# EAGLE board pc_badge_hrv_v1.1 (EAGLE 6.6.0), part 1 of 2
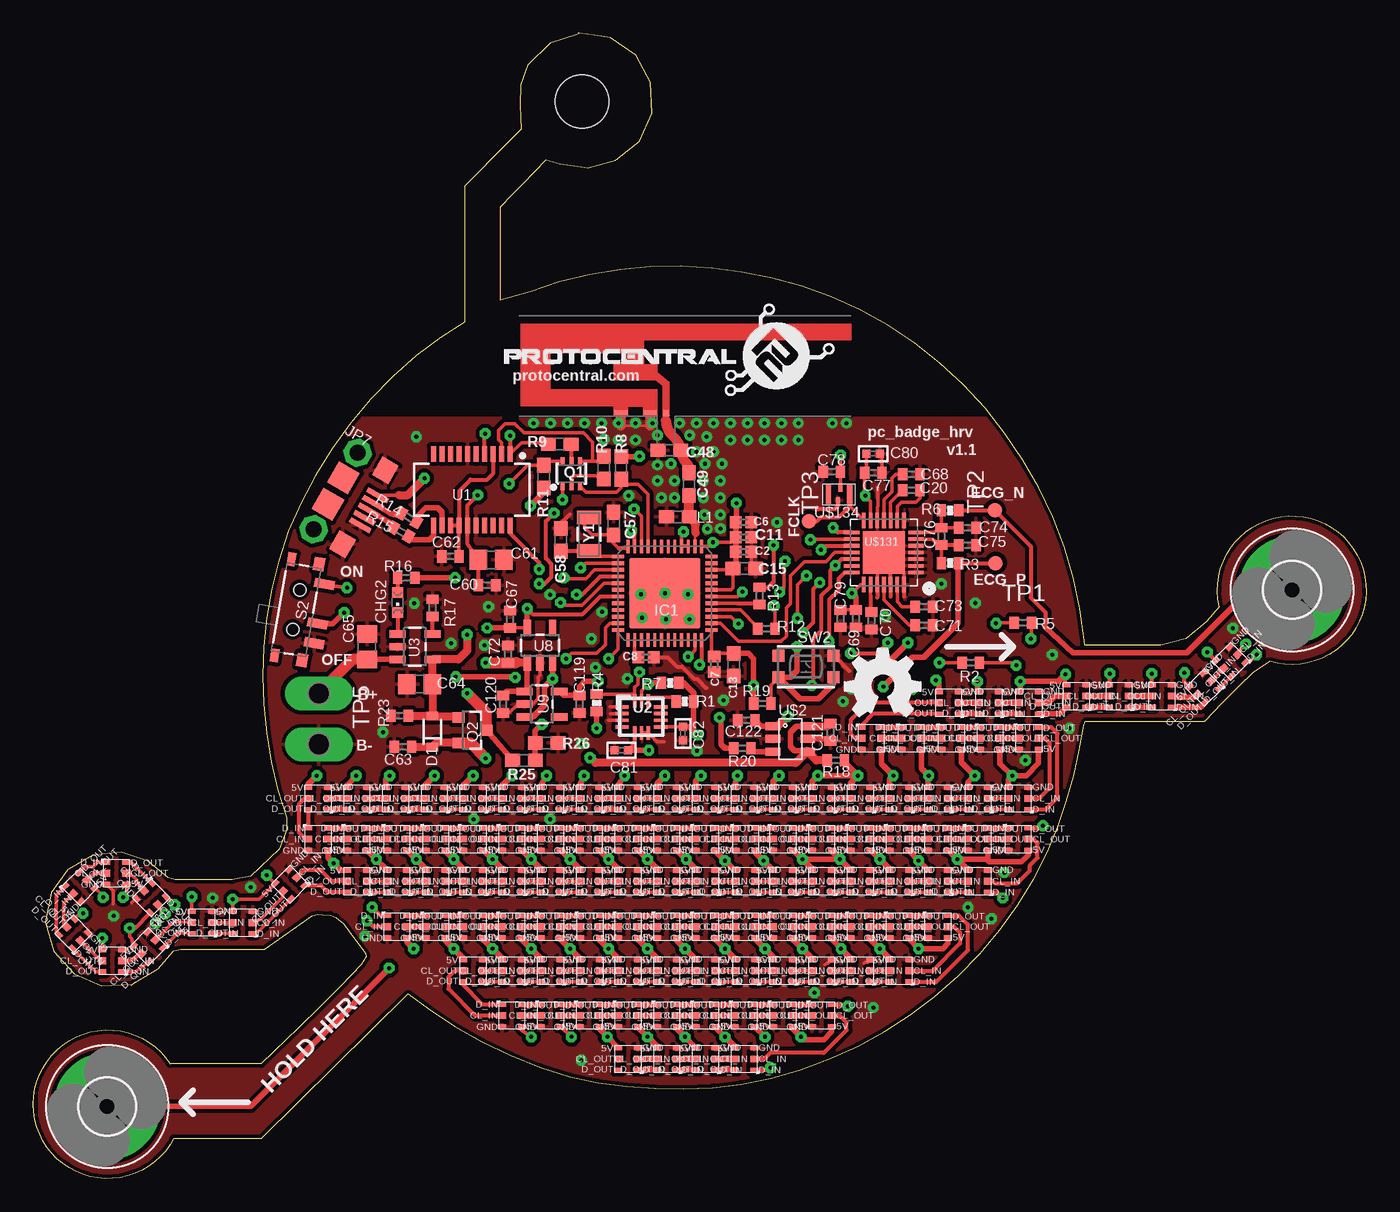
[diagram p3: board, top side]
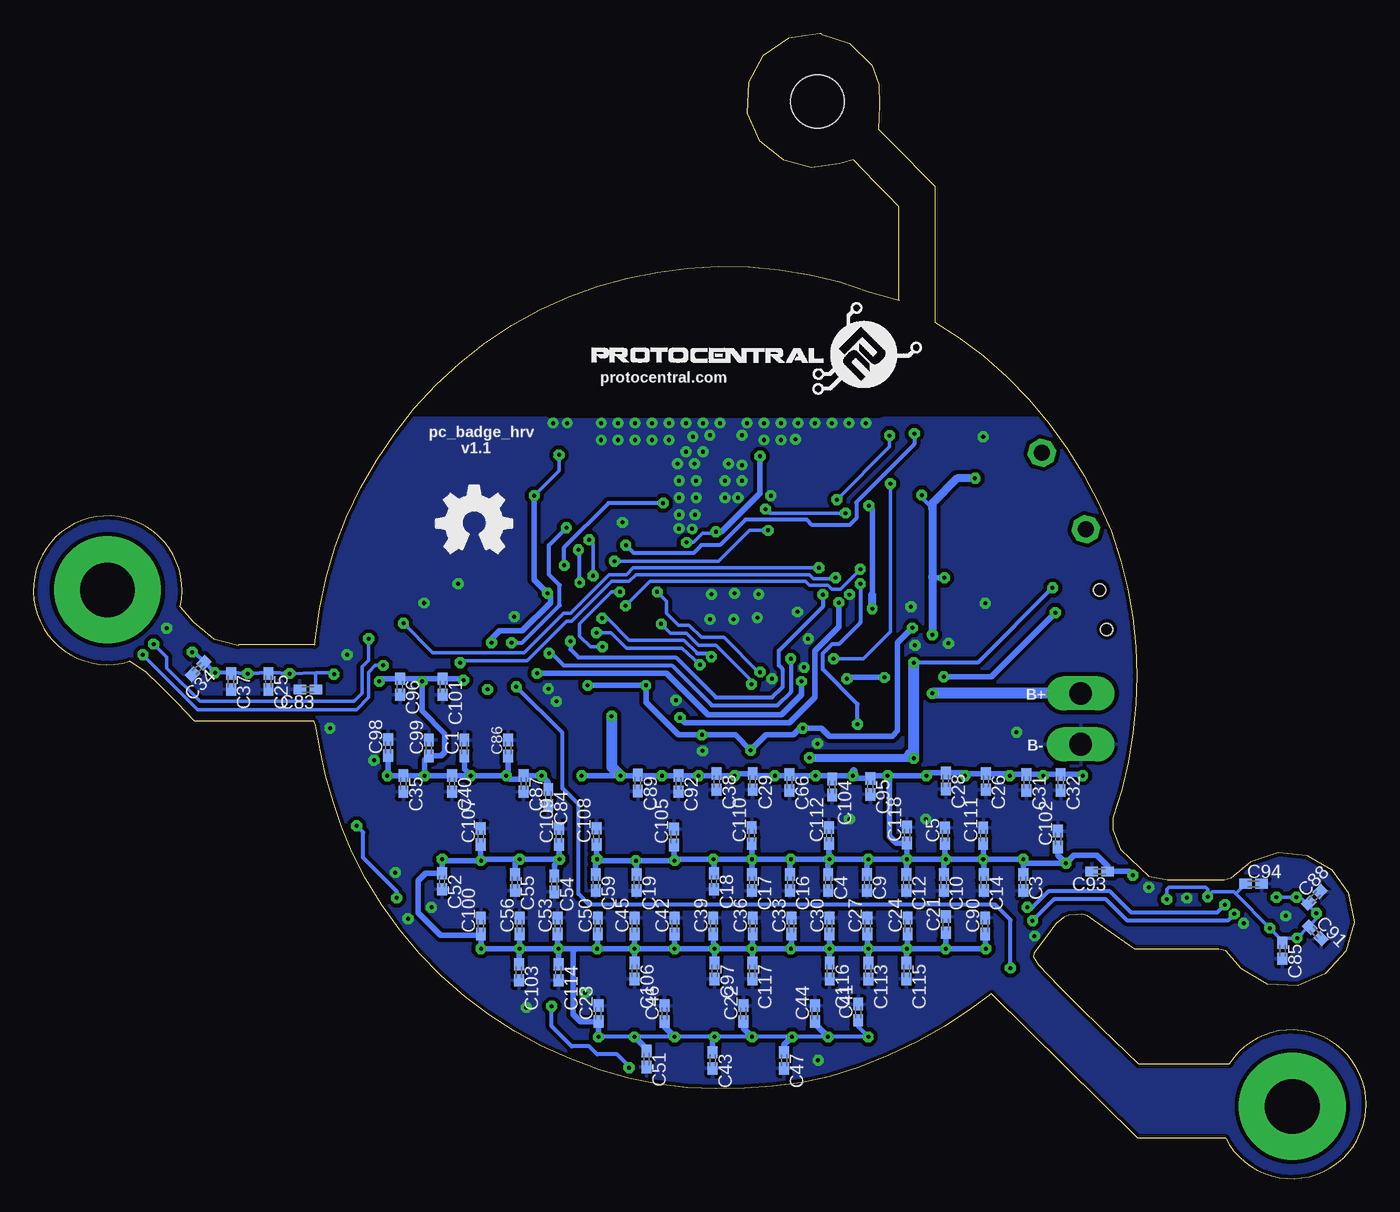
[diagram p4: board, bottom side, seen from below]

Size 99.76 x 85.69 mm. Coordinates in mm from the lower left corner, seen from the top.
Outline: 40.77,85.64 38.66,84.96 37.01,83.3 36.47,81.85 36.43,80.3 36.5,78.51 35.46,77.46 34.43,76.42 33.35,75.33 32.28,74.25 32.28,64.09 30.53,62.95 28.64,61.57 26.88,60.01 25.26,58.32 23.76,56.52 22.38,54.62 21.13,52.64 20.03,50.57 19.09,48.42 18.34,46.2 17.84,44.09 17.47,41.96 17.25,39.81 17.18,37.64 17.24,35.48 17.45,33.32 17.8,31.19 18.29,29.08 18.94,27.02 18.94,26.68 18.94,26.1 18.39,24.64 16.25,22.63 14.84,22.35
Outline: 14.88,22.36 10.62,22.38 10.1,22.51 8.59,23.76 6.56,24.41 4.44,24.18 2.58,23.13 1.32,21.4 0.88,19.18 1.52,17 3.04,15.32 5.12,14.42 7.38,14.54 9.32,15.69 10.52,17.06 11.03,17.15 17.3,17.15 19.43,18.66 20.88,19.68 21.26,19.78 21.64,19.74 22.23,19.71 22.63,19.57 23.22,19.07 24.04,17.96 24.86,16.85 24.9,16.59 24.51,15.98 23.01,14.39 21.45,12.86 19.84,11.29 17.06,8.59
Outline: 17.06,8.6 10.25,8.6
Outline: 10.5,3.01 17.1,3.01 28.04,13.82
Outline: 28.04,13.82 29.59,12.7 31.54,11.38 33.6,10.24 35.73,9.22 37.91,8.34 40.16,7.62 42.26,7.18 44.39,6.9 46.53,6.75 48.68,6.72 50.83,6.81 52.96,7.06 55.22,7.52 57.44,8.15 59.6,8.95 61.7,9.9 63.73,11.01 65.66,12.27 67.43,13.59 69.23,15.19 70.84,16.84 72.33,18.6 73.68,20.48 74.88,22.44 75.93,24.5 76.68,26.34 77.33,28.23 77.88,30.14 78.3,32.08 78.63,33.92 78.76,34.21 87.7,34.21 89,35.62 90.24,36.86 91.35,37.91 92.57,38.69
Outline: 88.77,42.8 87.8,41.65 86.28,40.41 84.38,39.93
Outline: 78.71,39.91 78.66,40.25 78.35,42.63 77.84,44.97 77.16,47.27 76.3,49.51 75.27,51.68 74.08,53.76 72.74,55.75 71.25,57.63 69.62,59.39 67.86,61.02 65.97,62.51 63.98,63.84 61.88,65 59.69,65.99 57.53,66.76 55.31,67.38 53.06,67.84 50.78,68.13 48.49,68.26 46.19,68.23 43.9,68.02 41.63,67.65 39.4,67.1 37.22,66.37 34.95,65.73
Outline: 34.98,65.73 34.98,72.72 35.83,73.61 36.69,74.49 37.54,75.36 38.39,76.24 39.41,75.93 41.53,75.63 43.59,76.19 45.37,77.64 46.29,79.73 46.19,82.02 45.12,84.05 43.21,85.38 41.99,85.54 40.87,85.69 40.77,85.69
Outline: 78.67,39.95 84.39,39.94
Outline: 88.77,42.8 arc-300 92.57,38.7
Outline: 10.51,3.01 arc-300 10.24,8.59
Copper layers (1*2*15*16): Top 0.035mm / dielectric 1.5mm / Route2 0.035mm / dielectric 0.15mm / Route15 0.035mm / dielectric 0.2mm / Bottom 0.035mm
Design rules "Circuitects-Rules": minimum track width 6mil, minimum drill 0.3mm, track to track 6mil, track to pad 6mil, pad to pad 6mil, via to via 6mil, smd to smd 6mil, copper to edge 10mil, drill to drill 8mil, minimum pad ring 12mil, minimum via ring 10mil, stop-mask expansion 4mil, vias tented up to drill 25mil, thermal gap 10mil
Net classes: 2 gnd: width 0.102 mm, drill 0.1 mm; 4 USBpair: width 0.102 mm, drill 0.1 mm, clearance 0.15 mm to class 3
Holes 4 mm at 41.07,80.6

## Footprints (pad centres in the part's own frame; a part is rotated, then mirrored left to right if it is on the bottom)
C0402K = smd 0.925 x 0.74: 1 -0.6,0; 2 0.6,0
0402 = smd 0.85 x 0.9: 1 -0.58,0; 2 0.58,0
0603 = smd 1.1 x 1: 1 -0.85,0; 2 0.85,0
C0402 = smd 0.7 x 0.9: 1 -0.65,0; 2 0.65,0
C0805 = smd 1.3 x 1.5: 1 -0.95,0; 2 0.95,0
_0402 = smd 0.6 x 0.6: 1 -0.508,0; 2 0.508,0
CHIPLED_0603 = smd 0.8 x 0.8: A 0,-0.75; C 0,0.75
SOD-323 = smd 0.63 x 0.83: A 1.15,0; C -1.15,0
TRACE_ANTENNA_2.4GHZ_25.7MM_TUNED = smd 0.46 x 0.46: ANT 0,0.23 | smd 1 x 0.46: GND -1.18,0.23; GND2 -3.38,0.23
4,1-PAD = drill 4.1 pad 8: B4,1 0,0
QFN48 = smd 1 x 0.3: 1 -3.5,2.75; 2 -3.5,2.25; 3 -3.5,1.75; 4 -3.5,1.25; 5 -3.5,0.75; 6 -3.5,0.25; 7 -3.5,-0.25; 8 -3.5,-0.75; 9 -3.5,-1.25; 10 -3.5,-1.75; 11 -3.5,-2.25; 12 -3.5,-2.75; 25 3.5,-2.75; 26 3.5,-2.25; 27 3.5,-1.75; 28 3.5,-1.25; 29 3.5,-0.75; 30 3.5,-0.25; 31 3.5,0.25; 32 3.5,0.75; 33 3.5,1.25; 34 3.5,1.75; 35 3.5,2.25; 36 3.5,2.75 | smd 0.3 x 1: 13 -2.75,-3.5; 14 -2.25,-3.5; 15 -1.75,-3.5; 16 -1.25,-3.5; 17 -0.75,-3.5; 18 -0.25,-3.5; 19 0.25,-3.5; 20 0.75,-3.5; 21 1.25,-3.5; 22 1.75,-3.5; 23 2.25,-3.5; 24 2.75,-3.5; 37 2.75,3.5; 38 2.25,3.5; 39 1.75,3.5; 40 1.25,3.5; 41 0.75,3.5; 42 0.25,3.5; 43 -0.25,3.5; 44 -0.75,3.5; 45 -1.25,3.5; 46 -1.75,3.5; 47 -2.25,3.5; 48 -2.75,3.5 | smd 5.309 x 5.309: EXP 0,0
MICRO-B = smd 0.4 x 1.75: 1 -1.25,2.975; 2 -0.6,2.975; 3 0.05,2.975; 4 0.7,2.975; 5 1.35,2.975 | smd 1.8 x 1.8: P$1 -1.1,0.1; P$2 1.2,0.1 | drill 1.2 pad 2 octagon: P$3 -3.25,0.1; P$4 3.35,0.1 | smd 1.6 x 1.4: P$5 -3.15,2.55; P$6 3.25,2.55
SC70-6 = smd 0.3 x 0.66: 1 -0.65,-0.92; 2 0,-0.92; 3 0.65,-0.92; 4 0.65,0.92; 5 0,0.92; 6 -0.65,0.92
SOT23-3 = smd 0.8 x 0.9: 1 -0.95,-1; 2 0.95,-1; 3 0,1.1
0402-RES = smd 0.7 x 0.9: 1 -0.65,0; 2 0.65,0
R0402 = smd 0.7 x 0.9: 1 -0.65,0; 2 0.65,0
SWITCH-SPST-SMD-A = smd 0.7 x 1.5: 1 -2.25,-1.75; 2 -0.75,-1.75; 3 2.25,-1.75 | smd 1 x 0.6: GND1 -3.65,1; GND3 3.65,1 | smd 1 x 0.8: GND2 -3.65,-1.1; GND4 3.65,-1.1 | hole 0.9: -1.5,0; 1.5,0
BTN_KMR2_4.6X2.8 = smd 0.9 x 0.9: A 2.05,0.8; A' -2.05,0.8; B 2.05,-0.8; B' -2.05,-0.8
TP11R = smd 1.1 x 1.1: TP 0,0
P2-38-17 = drill 1.702 pad 2.121 long: TP-1 -1.905,0; TP-2 1.905,0
SSOP20_L = smd 0.381 x 1.143: 1 -2.857,-2.68; 2 -2.223,-2.68; 3 -1.587,-2.68; 4 -0.953,-2.68; 5 -0.318,-2.68; 6 0.318,-2.68; 7 0.953,-2.68; 8 1.587,-2.68; 9 2.223,-2.68; 10 2.857,-2.68; 11 2.857,2.68; 12 2.223,2.68; 13 1.587,2.68; 14 0.953,2.68; 15 0.318,2.68; 16 -0.318,2.68; 17 -0.953,2.68; 18 -1.587,2.68; 19 -2.223,2.68; 20 -2.857,2.68
LGA14L = smd 1 x 0.25: 1 -1.45,0.75; 2 -1.45,0.25; 3 -1.45,-0.25; 4 -1.45,-0.75; 8 1.45,-0.75; 9 1.45,-0.25; 10 1.45,0.25; 11 1.45,0.75 | smd 0.25 x 1: 5 -0.5,-1.2; 6 0,-1.2; 7 0.5,-1.2; 12 0.5,1.2; 13 0,1.2; 14 -0.5,1.2
SOT23-5 = smd 0.55 x 1.2: 1 -0.95,-1.3; 2 0,-1.3; 3 0.95,-1.3; 4 0.95,1.3; 5 -0.95,1.3
SOT26 = smd 0.6 x 1.1: 1 -0.95,-1.3; 2 0,-1.3; 3 0.95,-1.3; 4 0.95,1.3; 5 0,1.3; 6 -0.95,1.3
APA102_2020 = smd 0.6 x 0.5: C_IN 0.25,1; CL_OUT 1.75,1 | smd 0.6 x 0.35: D_IN 0.25,1.825; D_OUT 1.75,1.825; GND 0.25,0.175; V_CC 1.75,0.175
QFN-28 = smd 1.15 x 0.27: 1 -2.4,1.5; 2 -2.4,1; 3 -2.4,0.5; 4 -2.4,0; 5 -2.4,-0.5; 6 -2.4,-1; 7 -2.4,-1.5; 15 2.4,-1.5; 16 2.4,-1; 17 2.4,-0.5; 18 2.4,0; 19 2.4,0.5; 20 2.4,1; 21 2.4,1.5 | smd 0.27 x 1.15: 8 -1.5,-2.4; 9 -1,-2.4; 10 -0.5,-2.4; 11 0,-2.4; 12 0.5,-2.4; 13 1,-2.4; 14 1.5,-2.4; 22 1.5,2.4; 23 1,2.4; 24 0.5,2.4; 25 0,2.4; 26 -0.5,2.4; 27 -1,2.4; 28 -1.5,2.4 | smd 3.15 x 3.15: THERMAL 0,0
SIT1533 = smd 0.4 x 1.4: 1 -0.8,0; 3 0.8,0 | smd 0.3 x 0.5: 2 -0.1,-0.45; 4 0.1,0.45
CRYSTAL-SMD-3.2X1.5MM = smd 1 x 1.8: P$1 -1.25,0; P$2 1.25,0

## Placement (x,y rotation side)
C1  [C0402K]  67.5,32.21 90 bottom
C2  0.1uF  [0402]  53.17,46.9 0 top
C3  [C0402K]  25.67,22.15 270 bottom
C4  [C0402K]  40.27,22.15 270 bottom
C5  [C0402K]  31.52,25.65 90 bottom
C6  0.1uF  [0402]  53.17,49.1 0 top
C7  0.1uF  [0402]  50.97,38.5 270 top
C8  0.1uF  [0402]  45.87,39 0 top
C9  [C0402K]  37.37,22.15 270 bottom
C10  [C0402K]  31.62,22.15 270 bottom
C11  0.1uF  [0402]  53.17,48 0 top
C12  [C0402K]  34.42,22.15 270 bottom
C13  10uF  [0603]  52.42,38.45 270 top
C14  [C0402K]  28.62,22.15 270 bottom
C15  10uF  [0603]  53.22,45.65 0 top
C16  [C0402K]  43.12,22.15 270 bottom
C17  [C0402K]  45.97,22.15 270 bottom
C18  [C0402K]  48.82,22.25 270 bottom
C19  [C0402K]  54.62,22.15 270 bottom
C20  1uF  [C0402]  65.72,51.5 180 top
C21  [C0402K]  31.47,19 90 bottom
C22  [C0402K]  46.62,12.35 90 bottom
C23  [C0402K]  57.47,12.35 90 bottom
C24  [C0402K]  34.32,18.9 90 bottom
C25  [C0402K]  82.17,37.19 270 bottom
C26  [C0402K]  28.47,29.7 270 bottom
C27  [C0402K]  37.32,18.9 90 bottom
C28  [C0402K]  31.47,29.75 270 bottom
C29  [C0402K]  45.92,29.7 270 bottom
C30  [C0402K]  40.17,18.9 90 bottom
C31  [C0402K]  25.42,29.65 270 bottom
C32  [C0402K]  22.87,29.65 270 bottom
C33  [C0402K]  43.02,18.9 90 bottom
C34  [C0402K]  87.42,38.17 225 bottom
C35  [C0402K]  72.07,29.55 270 bottom
C36  [C0402K]  45.92,18.9 90 bottom
C37  [C0402K]  84.97,37.2 270 bottom
C38  [C0402K]  48.62,29.7 270 bottom
C39  [C0402K]  48.87,18.9 90 bottom
C40  [C0402K]  68.42,29.55 270 bottom
C41  [C0402K]  38.02,12.45 90 bottom
C42  [C0402K]  51.77,18.9 90 bottom
C43  [C0402K]  48.92,8.85 270 bottom
C44  [C0402K]  41.27,12.35 90 bottom
C45  [C0402K]  54.77,18.9 90 bottom
C46  [C0402K]  52.52,12.35 90 bottom
C47  [C0402K]  43.57,8.85 270 bottom
C48  2.4pF  [0603]  47.61,54.51 180 top
C49  5.6pF  [0603]  49.08,51.97 90 top
C50  [C0402K]  57.52,18.9 90 bottom
C51  [C0402K]  53.87,8.95 270 bottom
C52  [C0402K]  69.17,22.25 270 bottom
C53  [C0402K]  60.52,18.9 90 bottom
C54  [C0402K]  60.77,22.05 270 bottom
C55  [C0402K]  63.72,22.15 270 bottom
C56  [C0402K]  63.37,18.9 90 bottom
C57  15pF  [0603]  43.42,49.01 270 top
C58  15pF  [0603]  39.49,47.8 270 top
C59  [C0402K]  57.67,22.15 270 bottom
C60  0.1uF  [C0402]  33.97,44.4 0 top
C61  10uF  [C0805]  34.27,46.3 0 top
C62  0.1uF  [C0402]  31.22,46.55 180 top
C63  1.0uF  [C0402]  27.67,32.3 180 top
C64  4.7u  [C0805]  28.92,37 180 top
C65  4.7u  [C0805]  24.97,39.8 90 top
C66  [C0402K]  43.17,29.65 270 bottom
C67  2.2uF  [C0402]  35.67,41.85 90 top
C68  1nF  [C0402]  65.72,52.7 0 top
C69  1uF  [C0402]  61.57,41.9 270 top
C70  10uF  [C0402]  62.72,41.75 270 top
C71  10uF  [C0402]  66.67,41.4 0 top
C72  1u  [C0402]  35.52,39.25 270 top
C73  1uF  [C0402]  66.67,42.8 0 top
C74  10pF  [C0402]  69.92,48.7 0 top
C75  10pF  [C0402]  69.92,47.4 0 top
C76  1000pF  [C0402]  67.97,48.05 90 top
C77  10uF  [C0402]  62.87,52.8 0 top
C78  1uF  [C0402]  59.77,52.9 180 top
C79  10uF  [C0402]  60.42,41.9 270 top
C80  1uF  [_0402]  62.87,54.25 0 top
C81  100nF  [_0402]  44.02,32.05 180 top
C82  100nF  [_0402]  48.62,33.3 270 top
C83  [C0402K]  79.22,36.6 180 bottom
C84  [C0402K]  61.22,28.51 270 bottom
C85  [C0402K]  6.27,17.05 270 bottom
C86  [C0402K]  64.22,32.21 90 bottom
C87  [C0402K]  63.07,29.55 270 bottom
C88  [C0402K]  3.87,21.05 45 bottom
C89  [C0402K]  54.52,29.6 270 bottom
C90  [C0402K]  28.52,18.9 90 bottom
C91  [C0402K]  3.79,18.39 315 bottom
C92  [C0402K]  51.47,29.55 270 bottom
C93  [C0402K]  19.94,22.98 180 bottom
C94  [C0402K]  8.42,22.05 0 bottom
C95  [C0402K]  37.12,29.35 270 bottom
C96  [C0402K]  72.32,36.8 270 bottom
C97  [C0402K]  48.77,15.54 270 bottom
C98  [C0402K]  73.21,32.26 90 bottom
C99  [C0402K]  70.16,32.23 90 bottom
C100  [C0402K]  66.27,18.9 90 bottom
C101  [C0402K]  69.12,36.8 270 bottom
C102  [C0402K]  23.07,25.4 90 bottom
C103  [C0402K]  63.42,15.44 270 bottom
C104  [C0402K]  39.97,29.3 270 bottom
C105  [C0402K]  51.82,25.55 90 bottom
C106  [C0402K]  54.77,15.54 270 bottom
C107  [C0402K]  66.28,25.6 90 bottom
C108  [C0402K]  57.62,25.61 90 bottom
C109  [C0402K]  60.43,25.59 90 bottom
C110  [C0402K]  45.99,25.66 90 bottom
C111  [C0402K]  28.67,25.65 90 bottom
C112  [C0402K]  40.21,25.67 90 bottom
C113  [C0402K]  37.27,15.54 270 bottom
C114  [C0402K]  60.46,15.44 270 bottom
C115  [C0402K]  34.4,15.54 270 bottom
C116  [C0402K]  40.16,15.54 270 bottom
C117  [C0402K]  45.95,15.54 270 bottom
C118  [C0402K]  34.37,25.7 90 bottom
C119  1u  [C0402]  40.87,35.5 90 top
C120  1u  [C0402]  35.17,35.5 90 top
C121  10uF  [C0402]  59.67,33.4 270 top
C122  10uF  [C0402]  53.37,34.3 180 top
CHG2  RED  [CHIPLED_0603]  27.27,43.1 180 top
D1  BAT20J  [SOD-323]  29.87,33.45 90 top
E1  ANTENNA  [TRACE_ANTENNA_2.4GHZ_25.7MM_TUNED]  47.35,57.05 0 top
H1  MOUNT-PAD-ROUND4.1  [4,1-PAD]  5.52,5.4 0 top
H2  MOUNT-PAD-ROUND4.1  [4,1-PAD]  94.22,44.05 0 top
IC1  CY8C29666_QFN48  [QFN48]  47.27,43.8 270 top
JP7  MICRO-B  [MICRO-B]  22.56,51.54 240 top
L1  2.7nH  [0603]  48.24,49.53 180 top
LOGO2  OSHW_LOGO_FILLX0200-NT  [OSHW_FILLX200_NOTEXT]  69.61,46.79 0 bottom
LOGO3  OSHW_LOGO_FILLX0200-NT  [OSHW_FILLX200_NOTEXT]  60.75,34.59 0 top
Q1  MBT3904DW1T1  [SC70-6]  40.27,52.74 0 top
Q2  2.5A/30V  [SOT23-3]  32.82,33.55 270 top
R1  10K  [0402-RES]  48.77,35.7 0 top
R2  330R  [R0402]  70.17,38.6 180 top
R3  49.9K  [0402-RES]  68.62,46.05 180 top
R4  10K  [0402-RES]  42.17,35.6 270 top
R5  330R  [R0402]  74.07,41.6 180 top
R6  49.9K  [0402-RES]  68.62,50 180 top
R7  10K  [0402-RES]  47.67,37.1 0 top
R8  10k  [0603]  44,53.18 90 top
R9  10k  [0603]  39.4,54.95 0 top
R10  10k  [0603]  42.7,53.2 270 top
R11  10k  [0603]  38.2,52.53 270 top
R12  1K  [R0402]  54.87,41.15 0 top
R13  1K  [R0402]  54.37,43.6 90 top
R14  27  [R0402]  28.11,49.46 330 top
R15  27  [R0402]  27.52,48.39 330 top
R16  330R  [R0402]  27.92,44.95 180 top
R17  1k  [R0402]  29.87,42.7 270 top
R18  DNP  [R0402]  60.07,31.3 0 top
R19  10K  [R0402]  54.57,35.55 180 top
R20  10k  [R0402]  53.07,32.2 180 top
R23  10K  [R0402]  27.42,34.65 0 top
R25  10k  [0603]  36.72,31.3 180 top
R26  10k  [0603]  38.42,32.6 180 top
S2  PCM12SMTR  [SWITCH-SPST-SMD-A]  19.68,42.57 80 top
SW2  KMR2  [BTN_KMR2_4.6X2.8]  57.84,38.31 0 top
TP1  TPSQTP11R  [TP11R]  72.02,46.05 90 top
TP2  TPSQTP11R  [TP11R]  71.97,50 90 top
TP3  TPSQTP11R  [TP11R]  58.07,49.2 0 top
TP5  PTR2  [P2-38-17]  21.37,34.4 270 top
U1  FTS31XS-U  [SSOP20_L]  32.82,51.55 180 top
U2  LSM6DS3  [LGA14L]  45.52,34.55 0 top
U3  MCP73831  [SOT23-5]  28.57,39.8 270 top
U8  AP2112K-3.3V  [SOT23-5]  37.92,39.9 0 top
U9  AP2112K-1.8V  [SOT23-5]  38.07,35.5 270 top
U$1  PROTY_LOGO_WITH_TEXT  [PROTY_WITH_TEXT@1]  57.96,59.03 0 bottom
U$2  AP2281  [SOT26]  56.67,32.9 270 top
U$9  APA1022020  [APA102_2020]  89.62,40.11 225 top
U$10  APA1022020  [APA102_2020]  87.65,38.15 225 top
U$11  APA1022020  [APA102_2020]  85.47,37.1 180 top
U$12  APA1022020  [APA102_2020]  82.27,37.1 180 top
U$13  APA1022020  [APA102_2020]  79.07,37.1 180 top
U$14  APA1022020  [APA102_2020]  75.52,36.6 180 top
U$15  APA1022020  [APA102_2020]  72.52,36.6 180 top
U$18  APA1022020  [APA102_2020]  69.52,36.6 180 top
U$19  APA1022020  [APA102_2020]  61.72,31.95 0 top
U$20  APA1022020  [APA102_2020]  64.72,31.95 0 top
U$21  APA1022020  [APA102_2020]  67.72,31.95 0 top
U$22  APA1022020  [APA102_2020]  70.62,31.95 0 top
U$24  APA1022020  [APA102_2020]  73.52,31.95 0 top
U$25  APA1022020  [APA102_2020]  74.72,29.45 180 top
U$26  PROTY_LOGO_WITH_TEXT  [PROTY_WITH_TEXT@1]  35.26,58.93 0 top
U$27  APA1022020  [APA102_2020]  71.72,29.45 180 top
U$28  APA1022020  [APA102_2020]  68.72,29.45 180 top
U$29  APA1022020  [APA102_2020]  65.82,29.45 180 top
U$30  APA1022020  [APA102_2020]  62.92,29.45 180 top
U$31  APA1022020  [APA102_2020]  60.02,29.45 180 top
U$32  APA1022020  [APA102_2020]  20.32,24.4 0 top
U$33  APA1022020  [APA102_2020]  23.22,24.4 0 top
U$34  APA1022020  [APA102_2020]  26.22,24.4 0 top
U$35  APA1022020  [APA102_2020]  29.12,24.4 0 top
U$36  APA1022020  [APA102_2020]  31.92,24.4 0 top
U$37  APA1022020  [APA102_2020]  34.82,24.4 0 top
U$38  APA1022020  [APA102_2020]  37.72,24.4 0 top
U$39  APA1022020  [APA102_2020]  40.62,24.4 0 top
U$40  APA1022020  [APA102_2020]  43.52,24.4 0 top
U$41  APA1022020  [APA102_2020]  46.42,24.4 0 top
U$42  APA1022020  [APA102_2020]  49.32,24.4 0 top
U$43  APA1022020  [APA102_2020]  52.32,24.4 0 top
U$44  APA1022020  [APA102_2020]  55.12,24.4 0 top
U$45  APA1022020  [APA102_2020]  58.02,24.4 0 top
U$46  APA1022020  [APA102_2020]  60.92,24.4 0 top
U$47  APA1022020  [APA102_2020]  63.82,24.4 0 top
U$48  APA1022020  [APA102_2020]  66.72,24.4 0 top
U$49  APA1022020  [APA102_2020]  69.72,24.4 0 top
U$50  APA1022020  [APA102_2020]  72.72,24.4 0 top
U$51  APA1022020  [APA102_2020]  71.72,23.25 180 top
U$52  APA1022020  [APA102_2020]  68.72,23.25 180 top
U$53  APA1022020  [APA102_2020]  65.82,23.25 180 top
U$54  APA1022020  [APA102_2020]  62.92,23.25 180 top
U$55  APA1022020  [APA102_2020]  60.02,23.25 180 top
U$56  APA1022020  [APA102_2020]  57.12,23.25 180 top
U$57  APA1022020  [APA102_2020]  54.32,23.25 180 top
U$58  APA1022020  [APA102_2020]  51.32,23.25 180 top
U$59  APA1022020  [APA102_2020]  48.42,23.25 180 top
U$60  APA1022020  [APA102_2020]  45.52,23.25 180 top
U$61  APA1022020  [APA102_2020]  42.62,23.25 180 top
U$62  APA1022020  [APA102_2020]  39.72,23.25 180 top
U$63  APA1022020  [APA102_2020]  36.82,23.25 180 top
U$64  APA1022020  [APA102_2020]  33.92,23.25 180 top
U$65  APA1022020  [APA102_2020]  31.12,23.25 180 top
U$66  APA1022020  [APA102_2020]  28.22,23.25 180 top
U$67  APA1022020  [APA102_2020]  25.22,23.25 180 top
U$68  APA1022020  [APA102_2020]  19.2,23.43 225 top
U$69  APA1022020  [APA102_2020]  16.67,20.15 180 top
U$70  APA1022020  [APA102_2020]  13.62,20.17 180 top
U$71  APA1022020  [APA102_2020]  8.61,18.76 225 top
U$72  APA1022020  [APA102_2020]  6.92,17.3 180 top
U$73  APA1022020  [APA102_2020]  4.42,18.32 135 top
U$74  APA1022020  [APA102_2020]  3.49,20.41 45 top
U$75  APA1022020  [APA102_2020]  5.22,21.85 0 top
U$76  APA1022020  [APA102_2020]  7.39,21.01 315 top
U$77  APA1022020  [APA102_2020]  26.22,17.85 0 top
U$78  APA1022020  [APA102_2020]  29.12,17.85 0 top
U$79  APA1022020  [APA102_2020]  31.92,17.85 0 top
U$80  APA1022020  [APA102_2020]  34.8,17.85 0 top
U$81  APA1022020  [APA102_2020]  37.72,17.85 0 top
U$82  APA1022020  [APA102_2020]  40.67,17.85 0 top
U$83  APA1022020  [APA102_2020]  43.52,17.85 0 top
U$84  APA1022020  [APA102_2020]  46.42,17.85 0 top
U$85  APA1022020  [APA102_2020]  49.32,17.85 0 top
U$86  APA1022020  [APA102_2020]  52.32,17.85 0 top
U$87  APA1022020  [APA102_2020]  55.12,17.85 0 top
U$88  APA1022020  [APA102_2020]  58.02,17.85 0 top
U$89  APA1022020  [APA102_2020]  60.92,17.85 0 top
U$90  APA1022020  [APA102_2020]  63.82,17.85 0 top
U$91  APA1022020  [APA102_2020]  66.72,17.85 0 top
U$92  APA1022020  [APA102_2020]  65.82,16.55 180 top
U$93  APA1022020  [APA102_2020]  62.92,16.55 180 top
U$94  APA1022020  [APA102_2020]  60.02,16.55 180 top
U$95  APA1022020  [APA102_2020]  57.12,16.55 180 top
U$96  APA1022020  [APA102_2020]  54.32,16.55 180 top
U$97  APA1022020  [APA102_2020]  51.32,16.55 180 top
U$98  APA1022020  [APA102_2020]  48.42,16.55 180 top
U$99  APA1022020  [APA102_2020]  45.52,16.55 180 top
U$100  APA1022020  [APA102_2020]  42.67,16.55 180 top
U$101  APA1022020  [APA102_2020]  39.72,16.55 180 top
U$102  APA1022020  [APA102_2020]  36.82,16.55 180 top
U$103  APA1022020  [APA102_2020]  33.92,16.55 180 top
U$104  APA1022020  [APA102_2020]  54.22,29.45 180 top
U$106  APA1022020  [APA102_2020]  34.82,11.2 0 top
U$107  APA1022020  [APA102_2020]  37.72,11.2 0 top
U$108  APA1022020  [APA102_2020]  40.62,11.2 0 top
U$109  APA1022020  [APA102_2020]  43.52,11.2 0 top
U$110  APA1022020  [APA102_2020]  46.42,11.2 0 top
U$111  APA1022020  [APA102_2020]  49.32,11.2 0 top
U$112  APA1022020  [APA102_2020]  52.22,11.2 0 top
U$113  APA1022020  [APA102_2020]  55.12,11.2 0 top
U$114  APA1022020  [APA102_2020]  58.02,11.2 0 top
U$115  APA1022020  [APA102_2020]  54.22,9.95 180 top
U$116  APA1022020  [APA102_2020]  51.32,9.95 180 top
U$117  APA1022020  [APA102_2020]  48.42,9.95 180 top
U$118  APA1022020  [APA102_2020]  45.52,9.95 180 top
U$119  APA1022020  [APA102_2020]  51.32,29.45 180 top
U$120  APA1022020  [APA102_2020]  48.42,29.45 180 top
U$121  APA1022020  [APA102_2020]  45.52,29.45 180 top
U$122  APA1022020  [APA102_2020]  42.62,29.45 180 top
U$123  APA1022020  [APA102_2020]  39.72,29.45 180 top
U$124  APA1022020  [APA102_2020]  36.82,29.45 180 top
U$125  APA1022020  [APA102_2020]  33.92,29.45 180 top
U$126  APA1022020  [APA102_2020]  31.02,29.45 180 top
U$127  APA1022020  [APA102_2020]  28.12,29.45 180 top
U$128  APA1022020  [APA102_2020]  25.22,29.45 180 top
U$129  APA1022020  [APA102_2020]  22.32,29.45 180 top
U$130  APA1022020  [APA102_2020]  57.12,29.45 180 top
U$131  MAX30003CTI+  [QFN-28]  63.67,46.85 180 top
U$134  SIT1533  [SIT1533]  60.32,51.2 0 top
Y1  32.768kHz  [CRYSTAL-SMD-3.2X1.5MM]  41.59,48.21 270 top